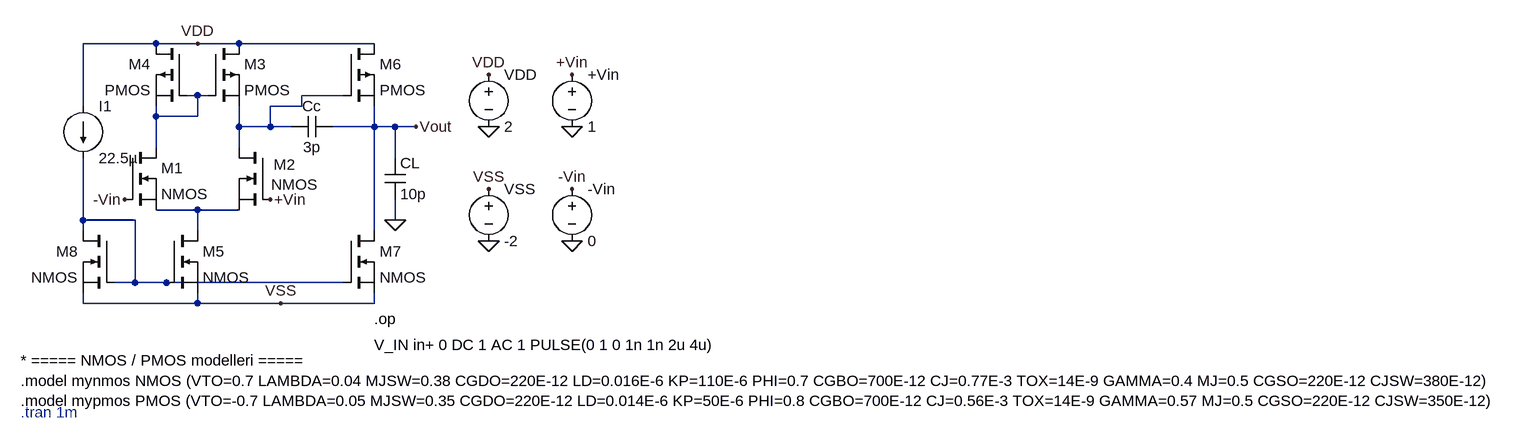
[diagram p0: schematic Ödev2-Unbuffered Op-Amp.asc]
Ödev2-Unbuffered Op-Amp.asc, the LTspice schematic file:
Version 4.1
SHEET 1 2968 1104
WIRE -48 -64 -160 -64
WIRE 16 -64 -48 -64
WIRE 80 -64 16 -64
WIRE 288 -64 80 -64
WIRE 16 16 0 16
WIRE 32 16 16 16
WIRE 240 16 176 16
WIRE -160 32 -160 -64
WIRE 176 32 176 16
WIRE 176 32 128 32
WIRE -48 48 -48 32
WIRE 16 48 16 16
WIRE 16 48 -48 48
WIRE 80 64 80 32
WIRE 128 64 128 32
WIRE 128 64 80 64
WIRE 160 64 128 64
WIRE 288 64 288 32
WIRE 288 64 224 64
WIRE 320 64 288 64
WIRE 352 64 320 64
WIRE -48 96 -48 48
WIRE 80 96 80 64
WIRE 320 112 320 64
WIRE 16 192 -48 192
WIRE 80 192 16 192
WIRE -160 208 -160 112
WIRE -80 208 -160 208
WIRE 320 208 320 176
WIRE -160 224 -160 208
WIRE 16 224 16 192
WIRE 288 224 288 64
WIRE -80 304 -80 208
WIRE -80 304 -112 304
WIRE -32 304 -80 304
WIRE 240 304 -32 304
WIRE -160 336 -160 320
WIRE 16 336 16 320
WIRE 16 336 -160 336
WIRE 144 336 16 336
WIRE 288 336 288 320
WIRE 288 336 144 336
FLAG 128 176 +Vin
FLAG -96 176 -Vin
FLAG 16 -64 VDD
FLAG 144 336 VSS
FLAG 320 208 0
FLAG 352 64 Vout
FLAG 464 240 0
FLAG 464 64 0
FLAG 464 -16 VDD
FLAG 464 160 VSS
FLAG 592 160 -Vin
FLAG 592 -16 +Vin
FLAG 592 64 0
FLAG 592 240 0
SYMBOL current -160 32 R0
SYMATTR InstName I1
SYMATTR Value 22.5µ
SYMBOL cap 224 48 R90
WINDOW 0 0 32 VBottom 2
WINDOW 3 32 32 VTop 2
SYMATTR InstName Cc
SYMATTR Value 3p
SYMBOL cap 304 112 R0
SYMATTR InstName CL
SYMATTR Value 10p
SYMBOL voltage 464 -32 R0
SYMATTR InstName VDD
SYMATTR Value 2
SYMBOL voltage 464 144 R0
SYMATTR InstName VSS
SYMATTR Value -2
SYMBOL nmos -96 96 R0
SYMATTR InstName M1
SYMBOL nmos 128 96 M0
WINDOW 0 -39 26 Left 2
WINDOW 3 -73 57 Left 2
SYMATTR InstName M2
SYMBOL pmos 32 -64 R0
SYMATTR InstName M3
SYMBOL pmos 0 -64 M0
SYMATTR InstName M4
SYMBOL nmos -32 224 R0
SYMATTR InstName M5
SYMBOL pmos 240 -64 R0
SYMATTR InstName M6
SYMBOL nmos 240 224 R0
SYMATTR InstName M7
SYMBOL nmos -112 224 M0
SYMATTR InstName M8
SYMBOL voltage 592 -32 R0
SYMATTR InstName +Vin
SYMATTR Value 1
SYMBOL voltage 592 144 R0
SYMATTR InstName -Vin
SYMATTR Value 0
TEXT -256 424 Left 2 !* ===== NMOS / PMOS modelleri =====\n.model mynmos NMOS (VTO=0.7 LAMBDA=0.04 MJSW=0.38 CGDO=220E-12 LD=0.016E-6 KP=110E-6 PHI=0.7 CGBO=700E-12 CJ=0.77E-3 TOX=14E-9 GAMMA=0.4 MJ=0.5 CGSO=220E-12 CJSW=380E-12)\n.model mypmos PMOS (VTO=-0.7 LAMBDA=0.05 MJSW=0.35 CGDO=220E-12 LD=0.014E-6 KP=50E-6 PHI=0.8 CGBO=700E-12 CJ=0.56E-3 TOX=14E-9 GAMMA=0.57 MJ=0.5 CGSO=220E-12 CJSW=350E-12)
TEXT -256 504 Left 2 ;.tran 1m
TEXT 288 400 Left 2 !V_IN in+ 0 DC 1 AC 1 PULSE(0 1 0 1n 1n 2u 4u)
TEXT 288 360 Left 2 !.op

The netlist it stands for:
* Ödev2-Unbuffered Op-Amp.asc
I1 VDD N004 22.5µ
Cc Vout N002 3p
CL Vout 0 10p
VDD VDD 0 2
VSS VSS 0 -2
M1 N001 -Vin N003 N003 NMOS
M2 N002 +Vin N003 N003 NMOS
M3 VDD N001 N002 N002 PMOS
M4 VDD N001 N001 N001 PMOS
M5 N003 N004 VSS VSS NMOS
M6 VDD N002 Vout Vout PMOS
M7 Vout N004 VSS VSS NMOS
M8 N004 N004 VSS VSS NMOS
V§+Vin +Vin 0 1
V§-Vin -Vin 0 0
.model NMOS NMOS
.model PMOS PMOS
.lib standard.mos
* ===== NMOS / PMOS modelleri =====
.model mynmos NMOS (VTO=0.7 LAMBDA=0.04 MJSW=0.38 CGDO=220E-12 LD=0.016E-6 KP=110E-6 PHI=0.7 CGBO=700E-12 CJ=0.77E-3 TOX=14E-9 GAMMA=0.4 MJ=0.5 CGSO=220E-12 CJSW=380E-12)
.model mypmos PMOS (VTO=-0.7 LAMBDA=0.05 MJSW=0.35 CGDO=220E-12 LD=0.014E-6 KP=50E-6 PHI=0.8 CGBO=700E-12 CJ=0.56E-3 TOX=14E-9 GAMMA=0.57 MJ=0.5 CGSO=220E-12 CJSW=350E-12)
* .tran 1m
V_IN in+ 0 DC 1 AC 1 PULSE(0 1 0 1n 1n 2u 4u)
.op
.backanno
.end